# EAGLE design PowerMeterCurrent (EAGLE 9.1.3)
DATABASE: ../../../../digikeydb.txt
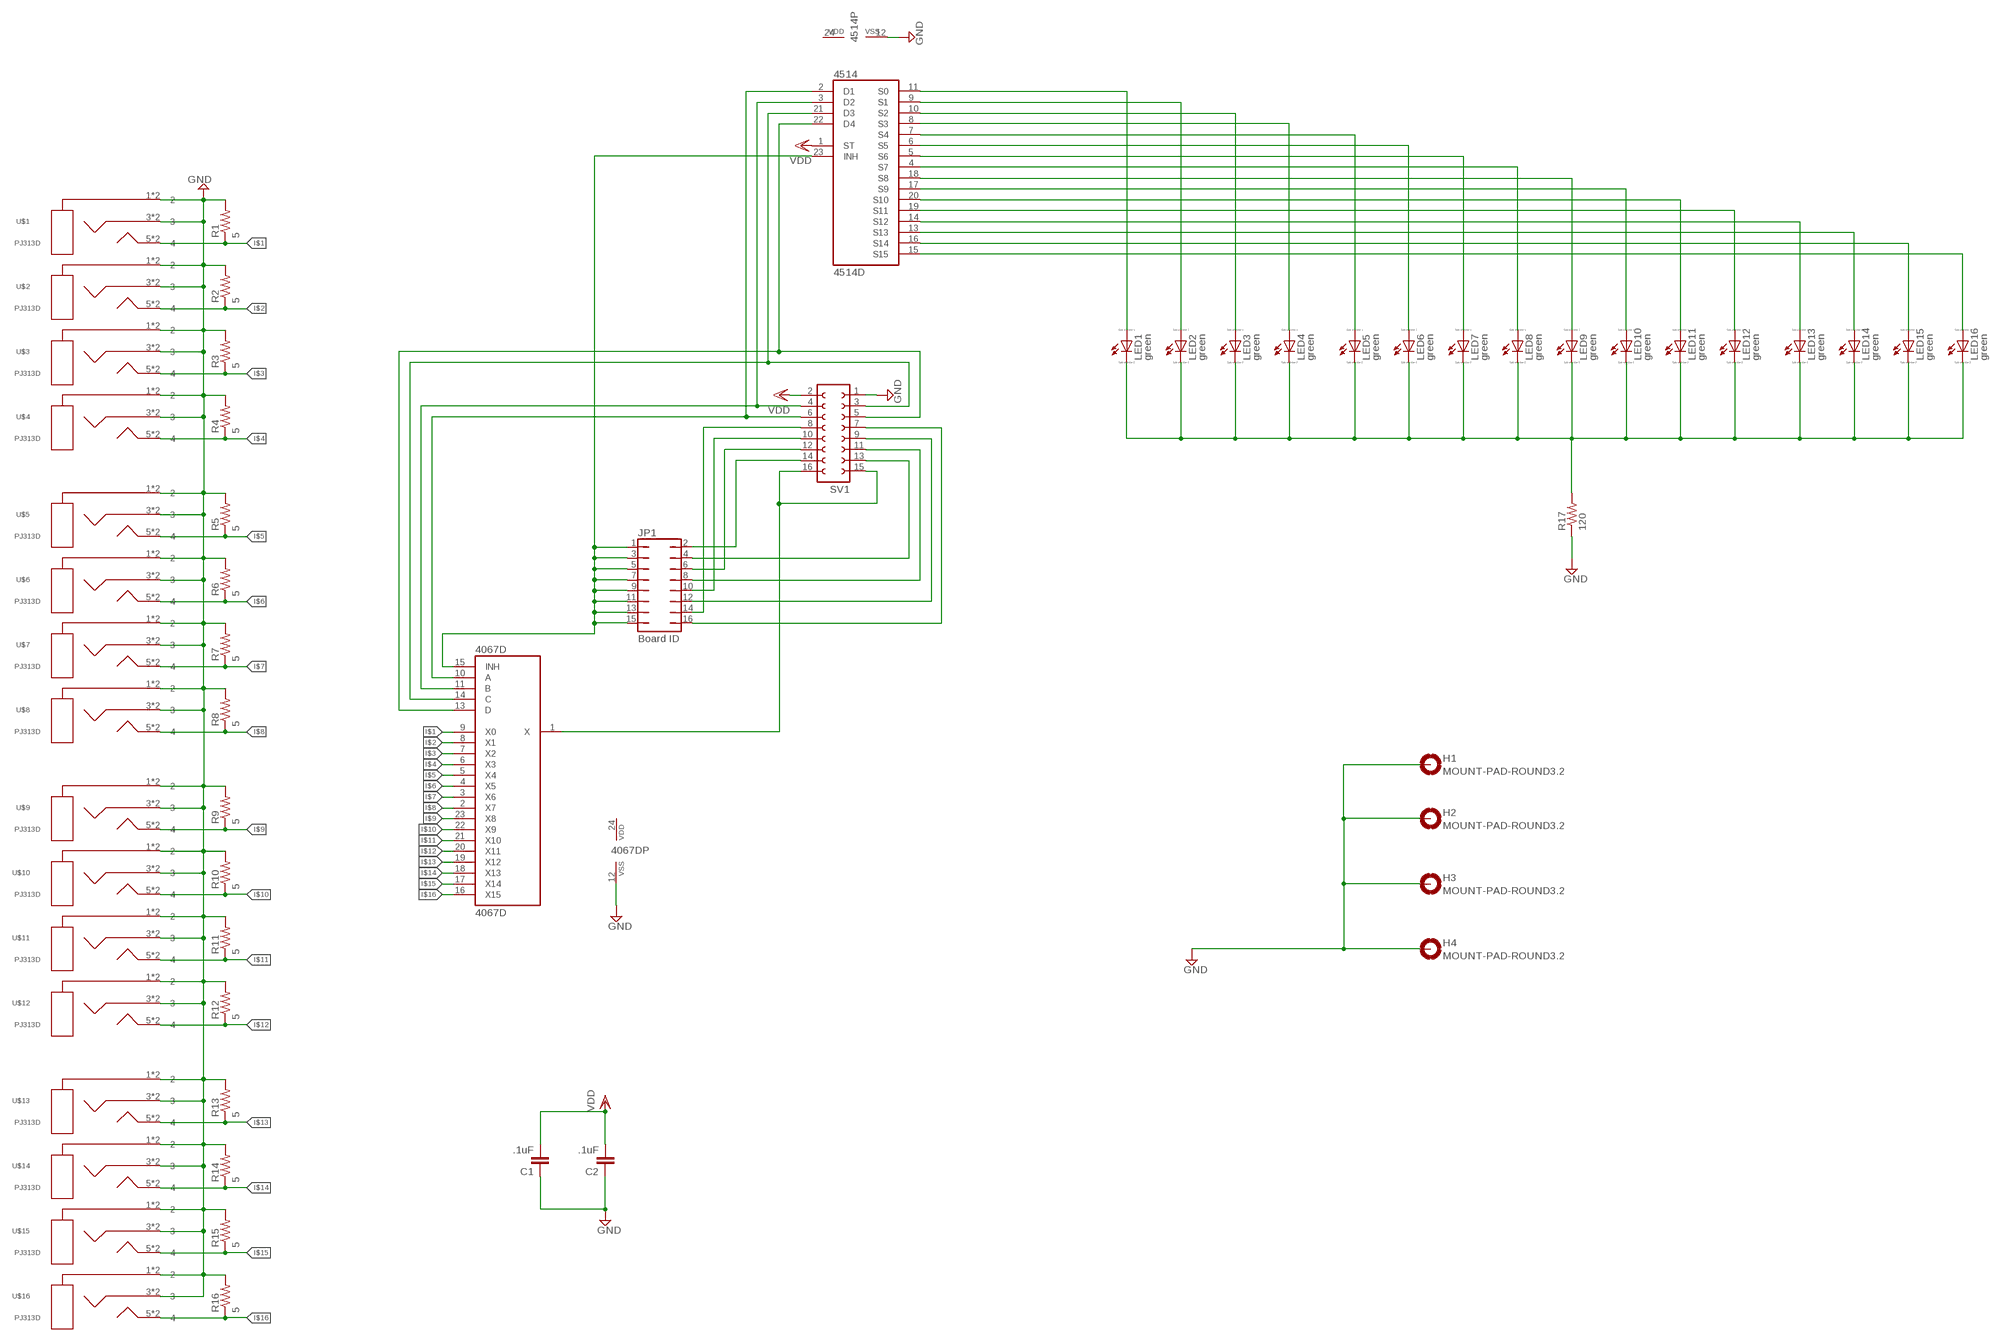
[diagram p0: schematic, sheet 1]

## Parts
4067D  4067D  [SO24W]
4514  4514D  [SO24W]
C1  .1uF  C-EUC1206  [C1206]
C2  .1uF  C-EUC1206  [C1206]
H1  MOUNT-PAD-ROUND3.2  [3,2-PAD]
H2  MOUNT-PAD-ROUND3.2  [3,2-PAD]
H3  MOUNT-PAD-ROUND3.2  [3,2-PAD]
H4  MOUNT-PAD-ROUND3.2  [3,2-PAD]
JP1  Board ID  JP8Q  [JP8Q]
LED1  green  LED_E  [LED_1206]
LED2  green  LED_E  [LED_1206]
LED3  green  LED_E  [LED_1206]
LED4  green  LED_E  [LED_1206]
LED5  green  LED_E  [LED_1206]
LED6  green  LED_E  [LED_1206]
LED7  green  LED_E  [LED_1206]
LED8  green  LED_E  [LED_1206]
LED9  green  LED_E  [LED_1206]
LED10  green  LED_E  [LED_1206]
LED11  green  LED_E  [LED_1206]
LED12  green  LED_E  [LED_1206]
LED13  green  LED_E  [LED_1206]
LED14  green  LED_E  [LED_1206]
LED15  green  LED_E  [LED_1206]
LED16  green  LED_E  [LED_1206]
R1  5  R-US_R1206  [R1206]
R2  5  R-US_R1206  [R1206]
R3  5  R-US_R1206  [R1206]
R4  5  R-US_R1206  [R1206]
R5  5  R-US_R1206  [R1206]
R6  5  R-US_R1206  [R1206]
R7  5  R-US_R1206  [R1206]
R8  5  R-US_R1206  [R1206]
R9  5  R-US_R1206  [R1206]
R10  5  R-US_R1206  [R1206]
R11  5  R-US_R1206  [R1206]
R12  5  R-US_R1206  [R1206]
R13  5  R-US_R1206  [R1206]
R14  5  R-US_R1206  [R1206]
R15  5  R-US_R1206  [R1206]
R16  5  R-US_R1206  [R1206]
R17  120  R-US_R1206  [R1206]
SV1  FE08-2  [FE08-2]
U$1  PJ313D  [PJ313D]
U$2  PJ313D  [PJ313D]
U$3  PJ313D  [PJ313D]
U$4  PJ313D  [PJ313D]
U$5  PJ313D  [PJ313D]
U$6  PJ313D  [PJ313D]
U$7  PJ313D  [PJ313D]
U$8  PJ313D  [PJ313D]
U$9  PJ313D  [PJ313D]
U$10  PJ313D  [PJ313D]
U$11  PJ313D  [PJ313D]
U$12  PJ313D  [PJ313D]
U$13  PJ313D  [PJ313D]
U$14  PJ313D  [PJ313D]
U$15  PJ313D  [PJ313D]
U$16  PJ313D  [PJ313D]

## Nets
GND: 4067D.12(VSS) 4514.12(VSS) C1.1 C2.1 H1.B3,2(MOUNT) H2.B3,2(MOUNT) H3.B3,2(MOUNT) H4.B3,2(MOUNT) R1.2 R2.2 R3.2 R4.2 R5.2 R6.2 R7.2 R8.2 R9.2 R10.2 R11.2 R12.2 R13.2 R14.2 R15.2 R16.2 R17.1 SV1.1 U$1.1 U$1.2 U$1.3 U$1.4 U$2.1 U$2.2 U$2.3 U$2.4 U$3.1 U$3.2 U$3.3 U$3.4 U$4.1 U$4.2 U$4.3 U$4.4 U$5.1 U$5.2 U$5.3 U$5.4 U$6.1 U$6.2 U$6.3 U$6.4 U$7.1 U$7.2 U$7.3 U$7.4 U$8.1 U$8.2 U$8.3 U$8.4 U$9.1 U$9.2 U$9.3 U$9.4 U$10.1 U$10.2 U$10.3 U$10.4 U$11.1 U$11.2 U$11.3 U$11.4 U$12.1 U$12.2 U$12.3 U$12.4 U$13.1 U$13.2 U$13.3 U$13.4 U$14.1 U$14.2 U$14.3 U$14.4 U$15.1 U$15.2 U$15.3 U$15.4 U$16.1 U$16.2 U$16.3 U$16.4
I$1: 4067D.9(X0) R1.1 U$1.5 U$1.6
I$2: 4067D.8(X1) R2.1 U$2.5 U$2.6
I$3: 4067D.7(X2) R3.1 U$3.5 U$3.6
I$4: 4067D.6(X3) R4.1 U$4.5 U$4.6
I$5: 4067D.5(X4) R5.1 U$5.5 U$5.6
I$6: 4067D.4(X5) R6.1 U$6.5 U$6.6
I$7: 4067D.3(X6) R7.1 U$7.5 U$7.6
I$8: 4067D.2(X7) R8.1 U$8.5 U$8.6
I$9: 4067D.23(X8) R9.1 U$9.5 U$9.6
I$10: 4067D.22(X9) R10.1 U$10.5 U$10.6
I$11: 4067D.21(X10) R11.1 U$11.5 U$11.6
I$12: 4067D.20(X11) R12.1 U$12.5 U$12.6
I$13: 4067D.19(X12) R13.1 U$13.5 U$13.6
I$14: 4067D.18(X13) R14.1 U$14.5 U$14.6
I$15: 4067D.17(X14) R15.1 U$15.5 U$15.6
I$16: 4067D.16(X15) R16.1 U$16.5 U$16.6
N$1: 4067D.10(A) 4514.2(D1) SV1.6
N$2: 4514.11(S0) LED1.A
N$3: 4067D.11(B) 4514.3(D2) SV1.4
N$4: 4067D.14(C) 4514.21(D3) SV1.3
N$5: 4067D.13(D) 4514.22(D4) SV1.5
N$6: 4067D.15(INH) 4514.23(INH) JP1.1 JP1.3 JP1.5 JP1.7 JP1.9 JP1.11 JP1.13 JP1.15
N$7: JP1.14 SV1.8
N$8: JP1.10 SV1.10
N$9: 4514.9(S1) LED2.A
N$10: JP1.6 SV1.12
N$11: JP1.2 SV1.14
N$12: 4067D.1(X) SV1.15 SV1.16
N$13: JP1.4 SV1.13
N$14: JP1.8 SV1.11
N$15: JP1.12 SV1.9
N$16: JP1.16 SV1.7
N$19: 4514.10(S2) LED3.A
N$21: LED1.C LED2.C LED3.C LED4.C LED5.C LED6.C LED7.C LED8.C LED9.C LED10.C LED11.C LED12.C LED13.C LED14.C LED15.C LED16.C R17.2
N$30: 4514.8(S3) LED4.A
N$32: 4514.7(S4) LED5.A
N$34: 4514.6(S5) LED6.A
N$36: 4514.5(S6) LED7.A
N$38: 4514.4(S7) LED8.A
N$40: 4514.18(S8) LED9.A
N$42: 4514.17(S9) LED10.A
N$44: 4514.20(S10) LED11.A
N$46: 4514.19(S11) LED12.A
N$48: 4514.14(S12) LED13.A
N$52: 4514.13(S13) LED14.A
N$54: 4514.16(S14) LED15.A
N$56: 4514.15(S15) LED16.A
VDD: 4514.1(ST) C1.2 C2.2 SV1.2

## Power pins joined to a net without a drawn wire
VDD: 4067D.24(VDD) 4514.24(VDD)

## Library data of the parts
4067D = 40xx:4067: 16-channel ANALOG MULTIPLEXER; PARTNO: 74HC4067D,652
4514 = 45xx:4514: 4-bit latch 4-16 line DECODER; PARTNO: 74HC154D,652
C1 C2 = rcl:C-EU: CAPACITOR, European symbol; PARTNO: C1206C104K5RAC7867
H1-H4 = holes:MOUNT-PAD-ROUND: MOUNTING PAD, round
JP1 = jumper:JP8Q: JUMPER; PARTNO: 67996-416HLF
LED1-LED16 = eagle-ltspice:LED_E: LED Source: http://www.osram.convergy.de Source: www.luxeon.com Source: www.kingbright.com; PARTNO: LTST-C150GKT; SPICEMODEL: NONE; SPICEPREFIX: D; SPICETYPE: diode
R1-R16 = resistor:R-US_: RESISTOR, American symbol; PARTNO: RC1206FR-077R5L
R17 = resistor:R-US_: RESISTOR, American symbol; PARTNO: RC1206FR-07120RL
SV1 = con-lsta:FE08-2: FEMALE HEADER; OC_FARNELL: unknown; OC_NEWARK: unknown; PARTNO: SSQ-108-02-T-D
U$1-U$16 = CraigJensen:PJ313D

## Board
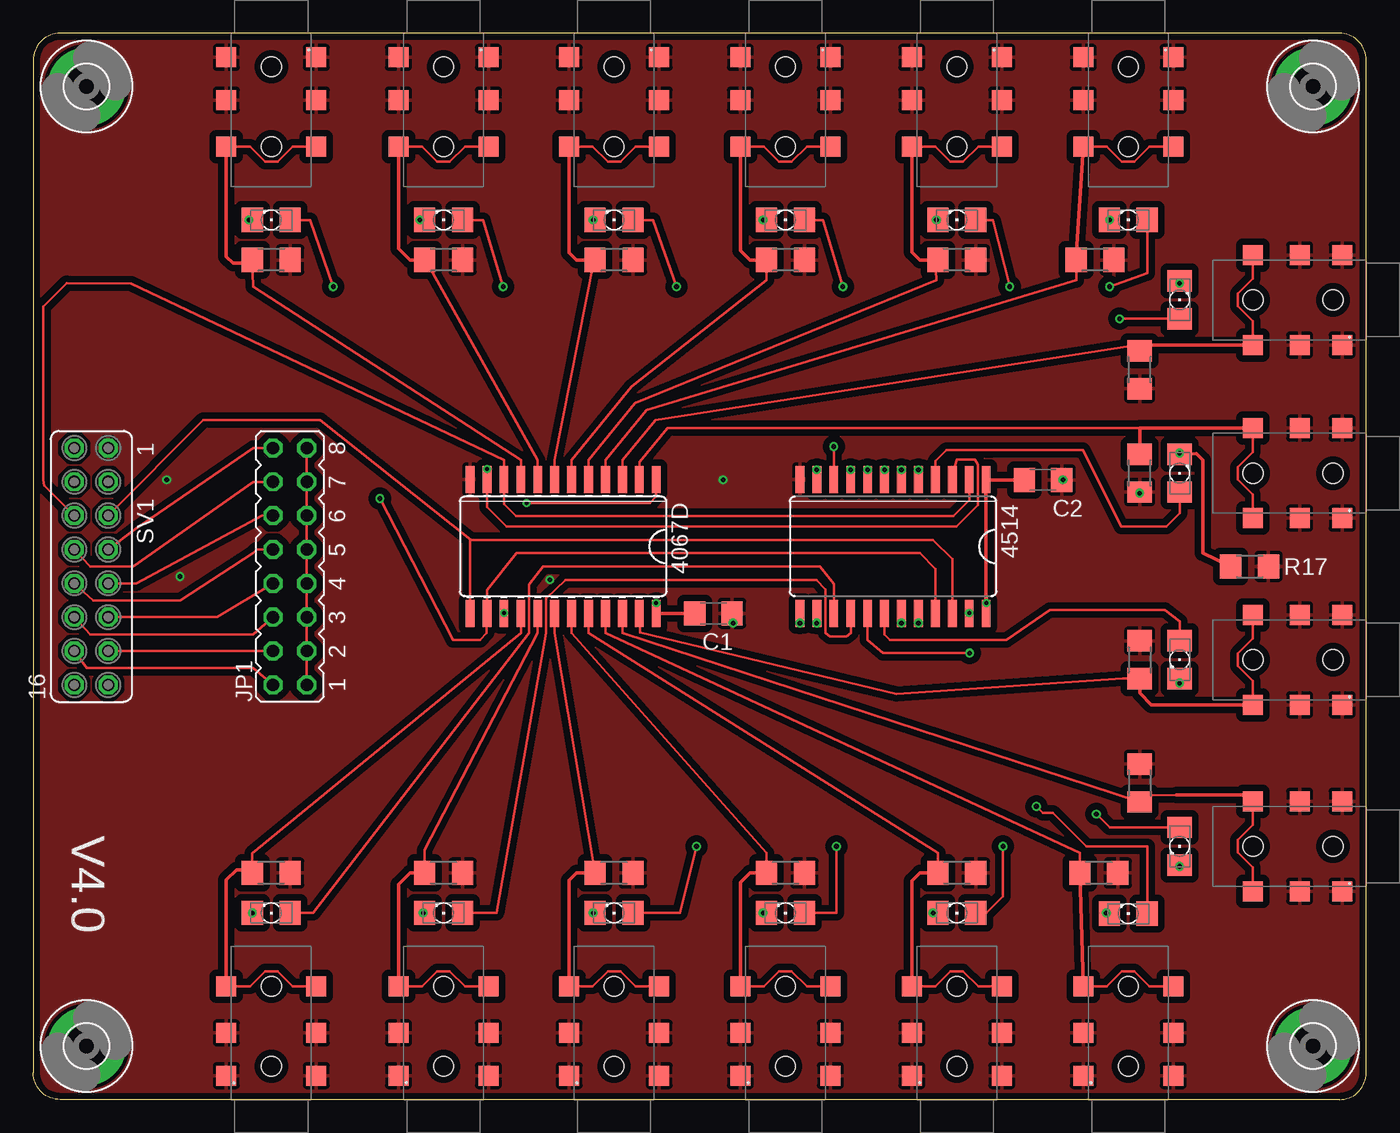
[diagram p1: board, top side]
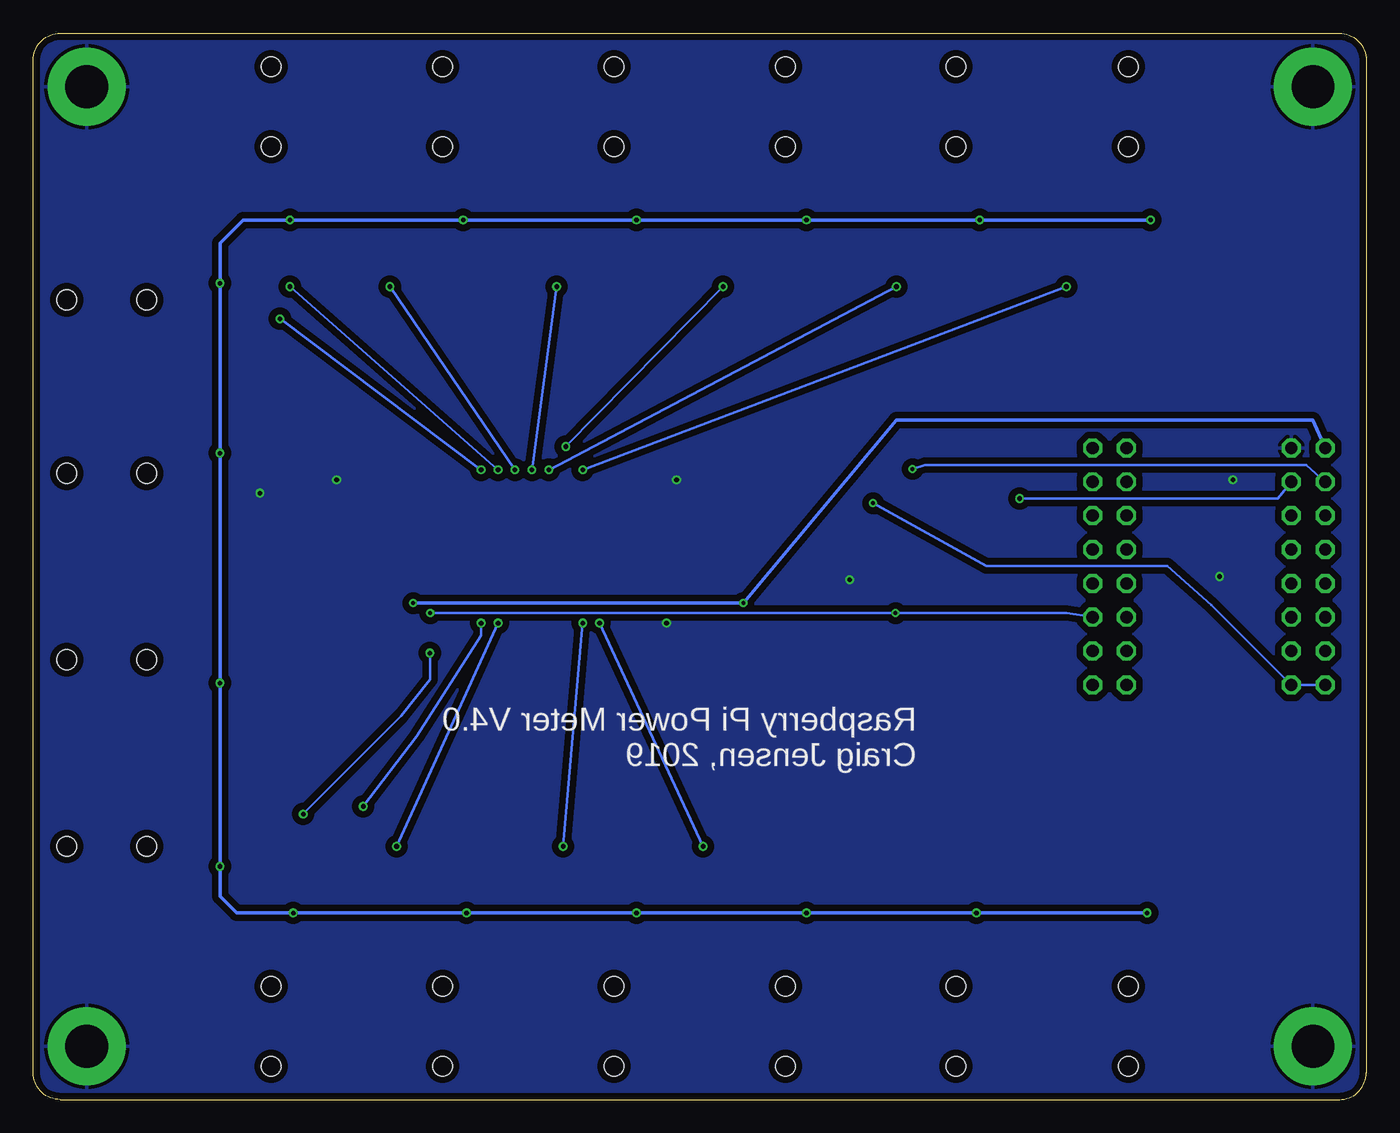
[diagram p2: board, bottom side, seen from below]

Size 100 x 80 mm. Coordinates in mm from the lower left corner, seen from the top.
Outline: 98,0 2,0 arc-90 0,2 0,78 arc-90 2,80 98,80 arc-90 100,78 100,2 arc-90 98,0
Copper layers (1*16): Top 0.035mm / dielectric 1.5mm / Bottom 0.035mm
Design rules "Elecrow_2-layer_eagle_rule": minimum track width 6mil, minimum drill 12mil, track to track 6mil, track to pad 6mil, pad to pad 6mil, via to via 6mil, smd to smd 0mil, copper to edge 10mil, drill to drill 10mil, minimum pad ring 10mil, minimum via ring 6mil, stop-mask expansion 2mil, vias tented up to drill 100mil, thermal gap 10mil

### Footprints (pad centres in the part's own frame; a part is rotated, then mirrored left to right if it is on the bottom)
SO24W = smd 0.66 x 2.032: 1 -6.985,-5.029; 2 -5.715,-5.029; 3 -4.445,-5.029; 4 -3.175,-5.029; 5 -1.905,-5.029; 6 -0.635,-5.029; 7 0.635,-5.029; 8 1.905,-5.029; 9 3.175,-5.029; 10 4.445,-5.029; 11 5.715,-5.029; 12 6.985,-5.029; 13 6.985,5.029; 14 5.715,5.029; 15 4.445,5.029; 16 3.175,5.029; 17 1.905,5.029; 18 0.635,5.029; 19 -0.635,5.029; 20 -1.905,5.029; 21 -3.175,5.029; 22 -4.445,5.029; 23 -5.715,5.029; 24 -6.985,5.029
C1206 = smd 1.6 x 1.8: 1 -1.4,0; 2 1.4,0
3,2-PAD = drill 3.2 pad 5.842: B3,2 0,0
JP8Q = drill 0.914 octagon: 1 -8.89,-1.27; 2 -8.89,1.27; 3 -6.35,-1.27; 4 -6.35,1.27; 5 -3.81,-1.27; 6 -3.81,1.27; 7 -1.27,-1.27; 8 -1.27,1.27; 9 1.27,-1.27; 10 1.27,1.27; 11 3.81,-1.27; 12 3.81,1.27; 13 6.35,-1.27; 14 6.35,1.27; 15 8.89,-1.27; 16 8.89,1.27
LED_1206 = smd 1.6 x 1.803: A -1.422,0; C 1.422,0
R1206 = smd 1.6 x 1.803: 1 -1.422,0; 2 1.422,0
FE08-2 = drill 0.914 octagon: 1 -8.89,1.27; 2 -8.89,-1.27; 3 -6.35,1.27; 4 -6.35,-1.27; 5 -3.81,1.27; 6 -3.81,-1.27; 7 -1.27,1.27; 8 -1.27,-1.27; 9 1.27,1.27; 10 1.27,-1.27; 11 3.81,1.27; 12 3.81,-1.27; 13 6.35,1.27; 14 6.35,-1.27; 15 8.89,1.27; 16 8.89,-1.27
PJ313D = smd 1.5 x 1.5: 1 1.8,3.375; 2 1.8,-3.375; 3 5,3.375; 4 5,-3.375; 5 8.5,3.375; 6 8.5,-3.375 | hole 1.5: 2.5,0; 8.5,0

### Placement (x,y rotation side)
4067D  39.75,41.5 180 top
4514  64.5,41.5 180 top
C1  51.02,36.47 180 top
C2  75.75,46.5 180 top
H1  4,76 0 top
H2  96,76 0 top
H3  96,4 0 top
H4  4,4 0 top
JP1  19.25,40 90 top
LED1  17.85,66 180 top
LED2  30.78,66 180 top
LED3  43.57,66 180 top
LED4  56.43,66 180 top
LED5  69.29,66 180 top
LED6  82.15,66 180 top
LED7  86,60 90 top
LED8  86,47 90 top
LED9  86,33 270 top
LED10  86,19 270 top
LED11  82.15,13.95 180 top
LED12  69.29,14 180 top
LED13  56.43,14 180 top
LED14  43.57,14 180 top
LED15  30.78,14 180 top
LED16  17.85,14 180 top
R1  17.85,63 0 top
R2  30.78,63 0 top
R3  43.57,63 0 top
R4  56.43,63 0 top
R5  69.29,63 0 top
R6  79.65,63 0 top
R7  83,54.75 270 top
R8  83,47 270 top
R9  83,33 90 top
R10  83,23.75 90 top
R11  79.94,17 0 top
R12  69.29,17 0 top
R13  56.43,17 0 top
R14  43.57,17 0 top
R15  30.78,17 0 top
R16  17.85,17 0 top
R17  91.25,40 180 top
SV1  4.35,40 270 top
U$1  17.85,80 270 top
U$2  30.78,80 270 top
U$3  43.57,80 270 top
U$4  56.43,80 270 top
U$5  69.29,80 270 top
U$6  82.15,80 270 top
U$7  100,60 180 top
U$8  100,47 180 top
U$9  100,33 180 top
U$10  100,19 180 top
U$11  82.15,0 90 top
U$12  69.29,0 90 top
U$13  56.43,0 90 top
U$14  43.57,0 90 top
U$15  30.78,0 90 top
U$16  17.85,0 90 top

### Tracks (layer width: path | path; a pad name or v marks a point on that pad's centre or on a via)
GND  (via drill 0.35)
  other vias: 38.75,39 11,39.25 51.75,46.5 52.5,35.75 10,46.5 77.25,46.5 83,45.5
  pour Top (isolate 0.5): -1,81 102,80.75 102,-3.25 -1.25,-3 -1.25,81
  pour Bottom (isolate 0.5): -2,81.75 104,81.75 104,-4.25 -2.25,-4.25 -2,31 -2,65.75
I$1
  Top 0.17: U$1.5 19.45,71.5 18.32,70.37 17.38,70.37 16.25,71.5 U$1.6 | 4067D.9 36.58,48 16.5,61 R1.1 16.18,62.75
  Top 0.25: 16.18,62.75 14.97,62.75 14.47,63.25 U$1.6
I$2
  Top 0.17: U$2.5 32.38,71.5 31.25,70.37 30.31,70.37 29.18,71.5 U$2.6 | 4067D.8 37.84,48 29.42,63 R2.1
  Top 0.25: U$2.6 27.41,63.84 28.25,63 29.42,63
I$3
  Top 0.17: U$3.5 45.17,71.5 44.04,70.37 43.1,70.37 41.97,71.5 U$3.6 | 4067D.7 39.12,48 42.07,63 R3.1
  Top 0.25: U$3.6 40.2,63.55 40.75,63 42.07,63
I$4
  Top 0.17: U$4.5 58.03,71.5 56.9,70.37 55.96,70.37 54.83,71.5 U$4.6 | 4067D.6 40.38,48 44.88,53.5 55,61.5 54.97,63 R4.1
  Top 0.25: U$4.6 53.05,63.7 53.75,63 54.97,63
I$5
  Top 0.17: U$5.5 70.89,71.5 69.76,70.37 68.82,70.37 67.69,71.5 U$5.6 | 4067D.5 41.66,48 45.16,52.25 67.75,61.5 67.68,62.92 | 67.47,63 67.68,62.92 | 67.68,62.92 R5.1
  Top 0.25: U$5.6 65.92,63.59 66.5,63 67.47,63
I$6
  Top 0.17: U$6.5 83.75,71.5 82.62,70.37 81.68,70.37 80.55,71.5 U$6.6 | 4067D.4 42.92,48 46,51.75 78.25,61.5 R6.1
  Top 0.25: U$6.6 R6.1
I$7
  Top 0.17: U$7.5 91.5,58.4 90.37,59.53 90.37,60.47 91.5,61.6 U$7.6 | 4067D.3 44.2,48 46.7,51 82.77,56.62 R7.1
  Top 0.25: U$7.5 82.77,56.62
I$8
  Top 0.17: U$8.5 91.5,45.4 90.37,46.53 90.37,47.47 91.5,48.6 U$8.6 | 4067D.2 45.47,47.84 47.6,50.38 83,50.38
  Top 0.25: U$8.6 83.25,50.38 83,50.38 R8.1
I$9
  Top 0.17: U$9.5 91.5,31.4 90.37,32.53 90.37,33.47 91.5,34.6 U$9.6 | 4067D.23 45.5,35.05 64.76,30.44 81.75,31.58 R9.1
  Top 0.25: U$9.5 83.88,29.62 83,30.5 R9.1
I$10
  Top 0.17: U$10.5 91.5,17.4 90.37,18.53 90.37,19.47 91.5,20.6 U$10.6 | 4067D.22 44.2,35 R10.1 83.5,22.83 85.75,22.88
  Top 0.25: 85.75,22.88 91,22.88 U$10.6
I$11
  Top 0.17: U$11.5 80.55,8.5 81.68,9.63 82.62,9.63 83.75,8.5 U$11.6 | 4067D.21 42.92,35 78.5,18.5 R11.1
  Top 0.25: U$11.5 R11.1
I$12
  Top 0.17: U$12.5 67.69,8.5 68.82,9.63 69.76,9.63 70.89,8.5 U$12.6 | 4067D.20 41.66,35 67.87,18.5 R12.1
  Top 0.25: U$12.5 65.92,16.41 66.5,17 R12.1
I$13
  Top 0.17: U$13.5 54.83,8.5 55.96,9.63 56.9,9.63 58.03,8.5 U$13.6 | 4067D.19 40.38,35 55.01,18.5 R13.1
  Top 0.25: U$13.5 53.05,16.3 53.75,17 R13.1
I$14
  Top 0.17: U$14.5 41.97,8.5 43.1,9.63 44.04,9.63 45.17,8.5 U$14.6 | 4067D.18 39.12,35 R14.1
  Top 0.25: U$14.5 40.2,16.45 40.75,17 R14.1
I$15
  Top 0.17: U$15.5 29.18,8.5 30.31,9.63 31.25,9.63 32.38,8.5 U$15.6 | 4067D.17 37.84,35 29.36,18.75 R15.1
  Top 0.25: R15.1 28.25,17 27.41,16.16 U$15.5
I$16
  Top 0.17: U$16.5 16.25,8.5 17.38,9.63 18.32,9.63 19.45,8.5 U$16.6 | 4067D.16 36.58,35 16.43,18.46 16.43,17.25 R16.1
  Top 0.25: 16.43,17.25 15.25,17.25 14.47,16.48 U$16.5
N$1
  Top 0.17: 4514.2 70.22,44.97 69.03,43.78 36.22,43.78 35.3,44.7 4067D.10 35.3,48 7.35,61.2 2.5,61.24 0.75,59.51 0.75,46.5 0.81,46.08 SV1.6
N$2  (via drill 0.35)
  Top 0.17: LED1.A 20.75,66 v22.5,61 | v58.78,47.25 4514.11
  Bottom 0.17: v22.5,61 v58.78,47.25
N$3  (via drill 0.3)
  Top 0.17: v34.03,47.31 4067D.11 34.03,44.47 35.5,43 69.25,43 70.85,44.6 70.85,47.64 70.64,48.02 69.29,48.02 68.94,46.93 4514.3
  Bottom 0.17: v34.03,47.31 33.09,47.6 14.6,47.6 11.75,47.6 4.5,47.6 SV1.4
N$4  (via drill 0.35)
  Top 0.17: 4514.21 67.67,39.83 66.5,41 36.25,41 34.03,38.25 4067D.14 34,36.44 34,35 33.5,34.5 31.5,34.5 v26,45.1
  Bottom 0.17: SV1.3 6.65,45.1 v26,45.1
N$5
  Top 0.17: 32.83,42 21.5,51 12.75,51 SV1.5 | 4067D.13 32.77,42 32.83,42 | 4514.22 68.94,40.55 67.5,42 32.83,42
N$6  (via drill 0.3)
  Top 0.17: JP1.15 JP1.13 JP1.11 JP1.9 20.52,41.5 20.52,40.5 JP1.7 20.5,39.25 JP1.5 JP1.3 20.5,34.25 JP1.1 | v70.22,36.5 4514.23 | v35.3,36.5 4067D.15
  Bottom 0.17: v70.22,36.5 v35.3,36.5 22.5,36.5 JP1.5
N$7
  Top 0.17: JP1.14 16.5,46.35 7.5,40 4.25,40 SV1.8
N$8
  Top 0.17: SV1.10 4.5,37.45 11,37.45 16.5,41.02 16.74,41.27 JP1.10
N$9  (via drill 0.35)
  Top 0.17: LED2.A 33.75,66 v35.25,61 | v61.33,47.25 4514.9
  Bottom 0.17: v35.25,61 v61.33,47.25
N$10
  Top 0.17: JP1.6 16.5,34.9 4.25,34.9 SV1.12
N$11
  Top 0.17: SV1.14 4,32.4 16.5,32.4 JP1.2
N$12  (via drill 0.3)
  Top 0.2: v37,44.75 46.25,44.75 46.73,45.23 4067D.1
  Bottom 0.2: v37,44.75 28.51,40.05 14.93,40.05 11.62,37.11 SV1.15 SV1.16
N$13
  Top 0.17: SV1.13 JP1.4
N$14
  Top 0.17: SV1.11 13.81,36.19 JP1.8
N$15
  Top 0.17: SV1.9 7.7,38.73 17.16,43.81 JP1.12
N$16
  Top 0.17: JP1.16 16.5,48.89 7.6,42.77 SV1.7
N$19  (via drill 0.35)
  Top 0.17: LED3.A 46.5,66 v48.25,61 | v60.05,49 4514.10
  Bottom 0.17: v48.25,61 v60.05,49
N$21  (via drill 0.35)
  Top 0.25: LED2.C v29,66 | LED3.C v42,66 | LED4.C v54.75,66 | LED5.C v67.75,66 | LED6.C v80.75,66 | LED7.C v86,61.25 | v86,48.5 LED8.C 87.25,48.48 87.75,48 87.75,41 R17.2 | LED9.C v86,31.25 | LED10.C v86,17.5 | LED11.C v80.5,14 | LED12.C v67.5,14 | LED13.C v54.75,14 | LED14.C v42,14 | LED15.C v29.25,14 | LED1.C v16.18,66
  Bottom 0.25: LED16.C v29.25,14 v42,14 v54.75,14 v67.5,14 v80.5,14 84.75,14 86,15.25 v86,17.5 v86,31.25 v86,48.5 v86,61.25 86,64.25 84.25,66 v80.75,66 v67.75,66 v54.75,66 v42,66 v29,66 v16.18,66
  other vias: 16.43,14
N$30  (via drill 0.35)
  Top 0.17: LED4.A 59.25,66 v60.74,61 | v62.59,47.25 4514.8
  Bottom 0.17: v60.74,61 v62.59,47.25
N$32  (via drill 0.35)
  Top 0.17: LED5.A 72,66 v73.25,61 | v63.87,47.25 4514.7
  Bottom 0.17: v73.25,61 v63.87,47.25
N$34  (via drill 0.35)
  Top 0.17: LED6.A 83.57,62 v80.75,61 | v65.14,47.25 4514.6
  Bottom 0.17: v80.75,61 v65.14,47.25
N$36  (via drill 0.35)
  Top 0.17: LED7.A v81.5,58.58 | v66.41,47.25 4514.5
  Bottom 0.17: v81.5,58.58 v66.41,47.25
N$38
  Top 0.17: LED8.A 86,44 85,43 81.62,43 78.75,48.75 69.75,48.75 68.5,48.75 67.67,47.92 4514.4
N$40
  Top 0.17: LED9.A 86,35.87 84.89,36.75 76.25,36.75 73,34.5 64.25,34.5 63.87,34.88 4514.18
N$42  (via drill 0.35)
  Top 0.17: LED10.A 80.75,20.42 v79.75,21.42 | v70.25,33.5 63.75,33.5 62.59,34.5 4514.17
  Bottom 0.17: v79.75,21.42 72.41,28.77 70.25,31.52 v70.25,33.5
N$44  (via drill 0.35)
  Top 0.17: LED11.A 83.57,19 79,19 76.5,21.5 75.75,21.5 v75.25,22 | v66.41,35.75 4514.20
  Bottom 0.17: v66.41,35.75 66.41,34.81 71.25,27.25 v75.25,22
N$46  (via drill 0.35)
  Top 0.17: LED12.A 71.5,14 72.75,15.25 v72.75,19 | v65.14,35.75 4514.19
  Bottom 0.17: v72.75,19 v65.14,35.75
N$48  (via drill 0.35)
  Top 0.17: LED13.A 60.25,14 v60.25,19 | v58.78,35.75 4514.14
  Bottom 0.17: v60.25,19 v58.78,35.75
N$52  (via drill 0.35)
  Top 0.17: LED14.A 48.5,14 v49.75,19 | v57.52,35.75 4514.13
  Bottom 0.17: v49.75,19 v57.52,35.75
N$54
  Top 0.17: LED15.A 34.75,14 38.48,35 38.48,37.59 39.94,39 58.75,39 59.42,38.28 59.42,35 59.75,34.75 61,34.75 61.33,35 4514.16
N$56
  Top 0.17: LED16.A 21,14 37.21,35 37.21,38.66 38.25,40 59,40 60.05,38.7 4514.15
VDD  (via drill 0.3)
  Top 0.25: 4514.1 71.48,46.5 | 71.48,46.5 C2.2 | 4514.24 71.48,38.25 | 71.48,38.25 71.48,46.5 | v46.73,37.25 4067D.24 C1.2 | 71.48,38.25 v71.5,37.25
  Bottom 0.25: SV1.2 4,51 35.25,51 v46.73,37.25 v71.5,37.25

### Text on the board
bPlace: Raspberry Pi Power Meter V4.0 / Craig Jensen, 2019
tNames: V4.0